# Altium schematic sheet Mainboard_RMII Header Connector.SchDoc
size A4
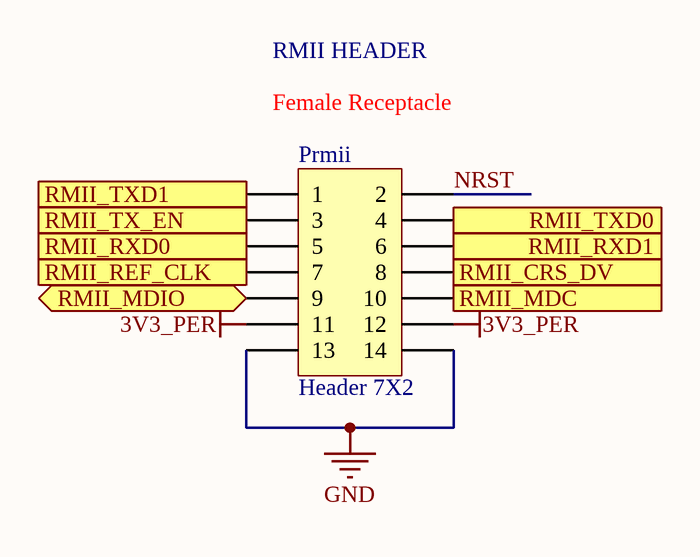
[diagram p0: Mainboard_RMII Header Connector.SchDoc]

## Parts
Prmii  Header 7X2  [HDR2X7]

## Ports
RMII_CRS_DV (out), RMII_MDC (in), RMII_MDIO (bidir), RMII_REF_CLK (in), RMII_RXD0 (out), RMII_RXD1 (out), RMII_TX_EN (in), RMII_TXD0 (in), RMII_TXD1 (in)

## Nets
3V3_PER: Prmii.11 Prmii.12
GND: Prmii.13 Prmii.14
NRST: Prmii.2
RMII_CRS_DV: Prmii.8 ; port RMII_CRS_DV
RMII_MDC: Prmii.10 ; port RMII_MDC
RMII_MDIO: Prmii.9 ; port RMII_MDIO
RMII_REF_CLK: Prmii.7 ; port RMII_REF_CLK
RMII_RXD0: Prmii.5 ; port RMII_RXD0
RMII_RXD1: Prmii.6 ; port RMII_RXD1
RMII_TX_EN: Prmii.3 ; port RMII_TX_EN
RMII_TXD0: Prmii.4 ; port RMII_TXD0
RMII_TXD1: Prmii.1 ; port RMII_TXD1

## Notes on the sheet
- RMII HEADER
- (near Prmii) Female Receptacle

## Library data of the parts
Prmii = Header 7X2: Header, 7-Pin, Dual row; LatestRevisionDate: 17-Jul-2002; LatestRevisionNote: Re-released for DXP Platform.; Publisher: Altium Limited